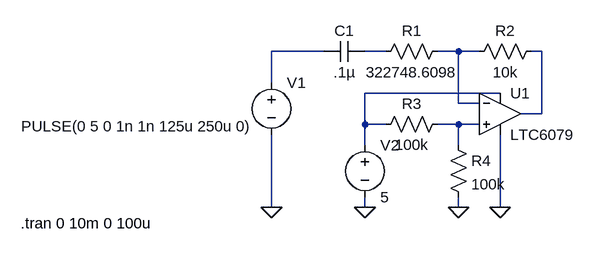
[diagram p0: schematic opamp simulation.asc]
opamp simulation.asc, the LTspice schematic file:
Version 4
SHEET 1 880 680
WIRE 16 128 -64 128
WIRE 112 128 80 128
WIRE 224 128 192 128
WIRE 256 128 224 128
WIRE 352 128 336 128
WIRE -64 176 -64 128
WIRE 288 192 80 192
WIRE 224 208 224 128
WIRE 256 208 224 208
WIRE 352 224 352 128
WIRE 352 224 320 224
WIRE 80 240 80 192
WIRE 112 240 80 240
WIRE 224 240 192 240
WIRE 256 240 224 240
WIRE 80 272 80 240
WIRE 224 272 224 240
WIRE -64 368 -64 256
WIRE 80 368 80 352
WIRE 224 368 224 352
WIRE 288 368 288 256
FLAG 224 368 0
FLAG 80 368 0
FLAG -64 368 0
FLAG 288 368 0
SYMBOL res 208 112 R90
WINDOW 0 0 56 VBottom 2
WINDOW 3 32 56 VTop 2
SYMATTR InstName R1
SYMATTR Value 322748.6098
SYMBOL res 352 112 R90
WINDOW 0 0 56 VBottom 2
WINDOW 3 32 56 VTop 2
SYMATTR InstName R2
SYMATTR Value 10k
SYMBOL Opamps\\LTC6079 288 224 R0
SYMATTR InstName U1
SYMBOL res 208 224 R90
WINDOW 0 0 56 VBottom 2
WINDOW 3 32 56 VTop 2
SYMATTR InstName R3
SYMATTR Value 100k
SYMBOL res 208 256 R0
SYMATTR InstName R4
SYMATTR Value 100k
SYMBOL voltage 80 256 R0
WINDOW 123 0 0 Left 2
WINDOW 39 0 0 Left 2
SYMATTR InstName V2
SYMATTR Value 5
SYMBOL cap 80 112 R90
WINDOW 0 0 32 VBottom 2
WINDOW 3 32 32 VTop 2
SYMATTR InstName C1
SYMATTR Value .1µ
SYMBOL voltage -64 160 R0
WINDOW 3 -385 83 Left 2
WINDOW 123 0 0 Left 2
WINDOW 39 0 0 Left 2
SYMATTR InstName V1
SYMATTR Value PULSE(0 5 0 1n 1n 125u 250u 0)
TEXT -450 392 Left 2 !.tran 0 10m 0 100u

The netlist it stands for:
* opamp simulation.asc
R1 N003 N002 322748.6098
R2 N004 N003 10k
XU1 N006 N003 N005 0 N004 LTC6078  ; LTC6079, pins In+ In- V+ V- OUT
R3 N006 N005 100k
R4 N006 0 100k
V2 N005 0 5
C1 N002 N001 .1µ
V1 N001 0 PULSE(0 5 0 1n 1n 125u 250u 0)
.tran 0 10m 0 100u
.lib LTC5.lib
.backanno
.end